# Altium project figo_pcb_v4.PrjPcb
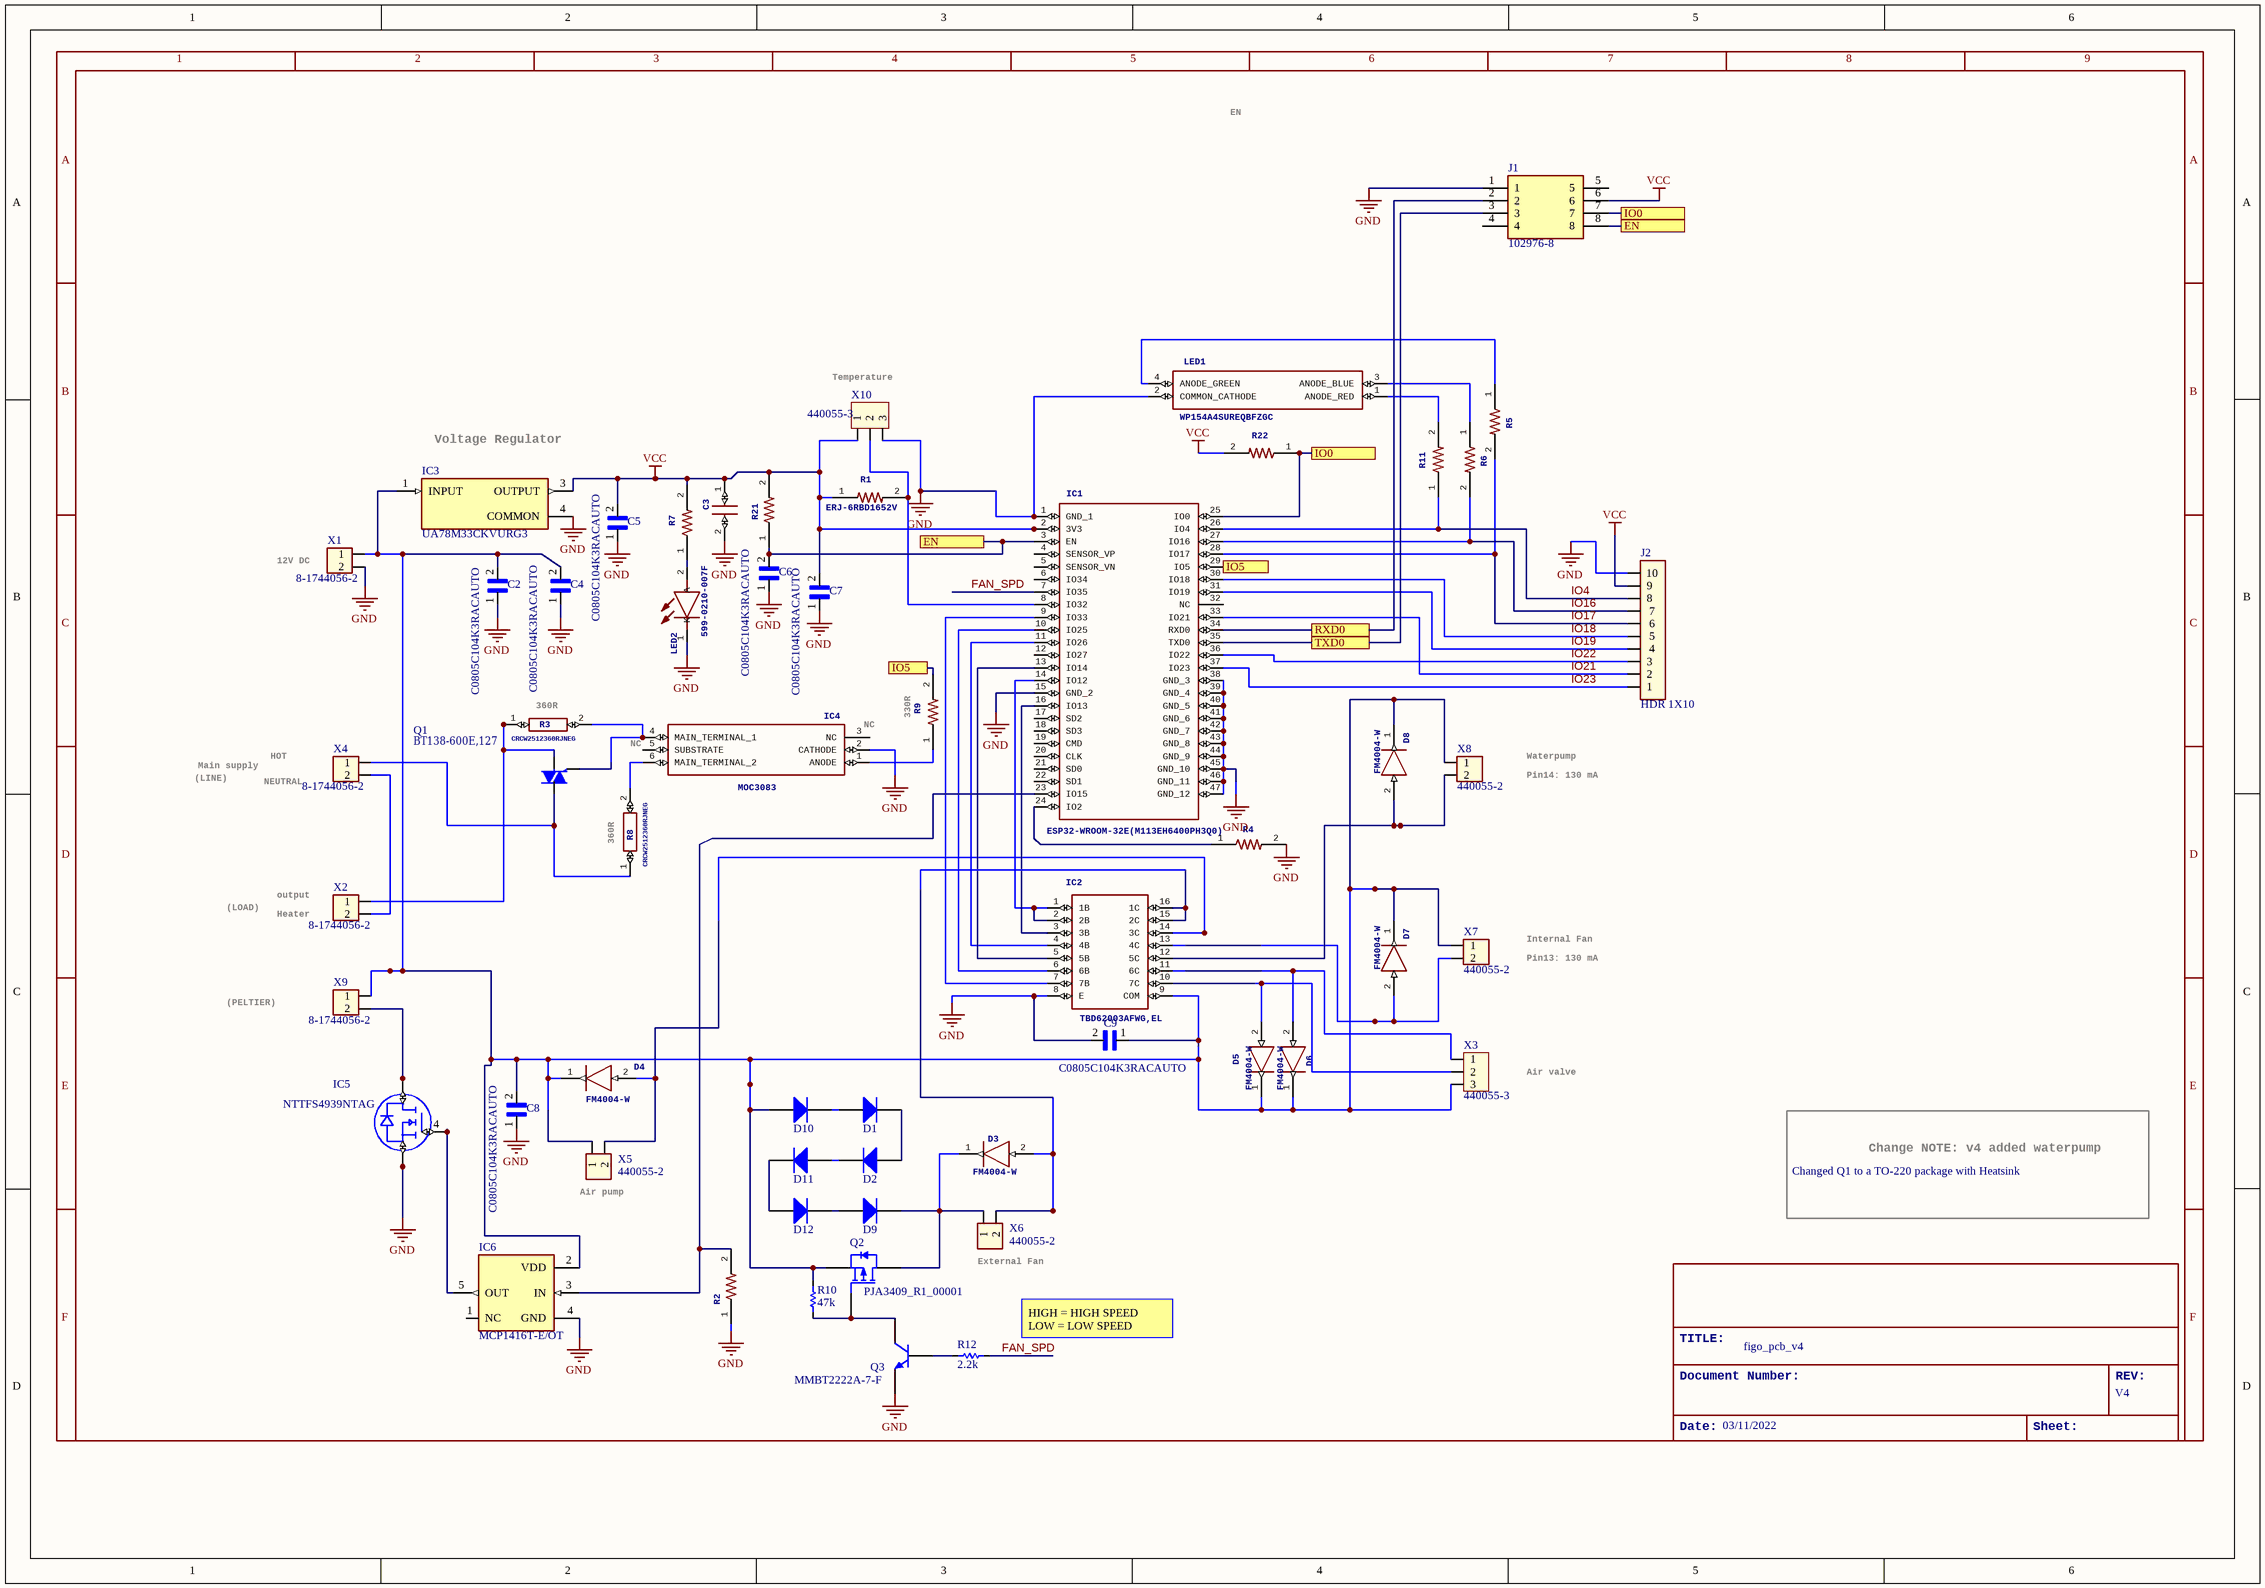
[diagram p0: figo_pcb_v4.SchDoc]
1 sheet, 57 parts. Net scope: flat (ports and power ports of the same name join across sheets).
Board file: figo_pcb_v4.PcbDoc

## Sheet figo_pcb_v4.SchDoc: figo_pcb_v2.1
size 453 x 317 mm; Date: 9/8/2021 10:17:15 AM; SheetNumber: 1; GateName_1: G$1; SymbolName_1: FRAME_B_L; LibraryName: frames; DeviceSetName: FRAME_B_L; GateName_2: G$2; SymbolName_2: DOCFIELD; Sheet: Sheet:; REV: REV:

### Parts
C2  C0805C104K3RACAUTO  [CAPC2012X88N]
C3  GRM21BR60J107ME15L  [CAPC2012X145N]  (value not drawn)
C4  C0805C104K3RACAUTO  [CAPC2012X88N]
C5  C0805C104K3RACAUTO  [CAPC2012X88N]
C6  C0805C104K3RACAUTO  [CAPC2012X88N]
C7  C0805C104K3RACAUTO  [CAPC2012X88N]
C8  C0805C104K3RACAUTO  [CAPC2012X88N]
C9  C0805C104K3RACAUTO  [CAPC2012X88N]
D1  Diode  [SOD-123F]  (value not drawn)
D2  Diode  [SOD-123F]  (value not drawn)
D3  FM4004-W  [DIONM5025X231N]
D4  FM4004-W  [DIONM5025X231N]
D5  FM4004-W  [DIONM5025X231N]
D6  FM4004-W  [DIONM5025X231N]
D7  FM4004-W  [DIONM5025X231N]
D8  FM4004-W  [DIONM5025X231N]
D9  Diode  [SOD-123F]  (value not drawn)
D10  Diode  [SOD-123F]  (value not drawn)
D11  Diode  [SOD-123F]  (value not drawn)
D12  Diode  [SOD-123F]  (value not drawn)
IC1  ESP32-WROOM-32E(M113EH6400PH3Q0)  [ESP32WROOM32D4MB]
IC2  TBD62003AFWG,EL  [SOIC127P600X175-16N]
IC3  UA78M33CKVURG3  [TO229P990X252-3N]
IC4  MOC3083  [DIP762W60P254L750H600Q6N]
IC5  NTTFS4939NTAG  [DFN330X330X75-8N]
IC6  MCP1416T-E/OT  [SOT23-5]
J1  102976-8  [TE_102976-8]
J2  HDR 1X10  [TH,POS-10S, R/A LOCK, 2.54mm]
LED1  WP154A4SUREQBFZGC  [L-154A4SUREQBFZGEC]
LED2  599-0210-007F  [LEDC3216X90N]
Q1  ‎BT138-600E,127‎  [TO254P1040X460X1975-3]
Q2  Manufacturer Part Number: PJA3409_R1_00001  [SOT23]  (hidden comment: MOSFET-P_D)
Q3  Manufacturer Part Number: MMBT2222A-7-F  [SOT23]  (hidden comment: NPN)
R1  ERJ-6RBD1652V  [RESC2012X70]
R2  ERJ-6RBD1652V  [RESC2012X70]  (value not drawn)
R3  CRCW2512360RJNEG  [RESC6332X70N]
R4  ERJ-6RBD1652V  [RESC2012X70]  (value not drawn)
R5  ERJ-6RBD1652V  [RESC2012X70]  (value not drawn)
R6  ERJ-6RBD1652V  [RESC2012X70]  (value not drawn)
R7  ERJ-6RBD1652V  [RESC2012X70]  (value not drawn)
R8  CRCW2512360RJNEG  [RESC6332X70N]
R9  ERJ-6RBD1652V  [RESC2012X70]  (value not drawn)
R10  Val: 47k  [R0805]
R11  ERJ-6RBD1652V  [RESC2012X70]  (value not drawn)
R12  Val: 2.2k  [R0805]
R21  ERJ-6RBD1652V  [RESC2012X70]  (value not drawn)
R22  ERJ-6RBD1652V  [RESC2012X70]  (value not drawn)
X1  8-1744056-2  [TE-ECOPWR-2S R/A, 3.96mm]
X2  8-1744056-2  [TE-ECOPWR-2S R/A, 3.96mm]
X3  440055-3  [TE-HPI-3P TH R/A 2.0mm]
X4  8-1744056-2  [TE-ECOPWR-2S R/A, 3.96mm]
X5  440055-2  [TE-HPI-2P TH R/A 2.0mm]
X6  440055-2  [TE-HPI-2P TH R/A 2.0mm]
X7  440055-2  [TE-HPI-2P TH R/A 2.0mm]
X8  440055-2  [TE-HPI-2P TH R/A 2.0mm]
X9  8-1744056-2  [TE-ECOPWR-2S R/A, 3.96mm]
X10  440055-3  [TE-HPI-3P TH R/A 2.0mm]

### Ports
EN, IO0, IO5, RXD0, TXD0

### Nets
GND: C2.1 C3.2 C4.1 C5.1 C6.1 C7.1 C8.1 C9.2 IC1.1(GND_1) IC1.15(GND_2) IC1.38(GND_3) IC1.39(GND_4) IC1.40(GND_5) IC1.41(GND_6) IC1.42(GND_7) IC1.43(GND_8) IC1.44(GND_9) IC1.45(GND_10) IC1.46(GND_11) IC1.47(GND_12) IC2.8(E) IC3.4(COMMON) IC4.2(CATHODE) IC5.1(S) IC5.2(S) IC5.3(S) IC6.4(GND) J1.1 J2.10 LED1.2(COMMON_CATHODE) LED2.1(K) Q3.2(E) R2.1 R4.2 X1.2 X10.3
VCC: C3.1 C5.2 C7.2 IC1.2(3V3) IC3.3(OUTPUT) J1.6 J2.9 R1.1 R7.2 R21.2 R22.2 X10.1
FAN_SPD: IC1.7(IO35) R12.2
IO4: IC1.26(IO4) J2.8 R11.1
IO16: IC1.27(IO16) J2.7 R6.2
IO17: IC1.28(IO17) J2.6 R5.2
IO18: IC1.30(IO18) J2.5
IO19: IC1.31(IO19) J2.4
IO21: IC1.33(IO21) J2.2
IO22: IC1.36(IO22) J2.3
IO23: IC1.37(IO23) J2.1
NetC2_2: C2.2 C4.2 C8.2 C9.1 D4.1(K) D5.1(K) D6.1(K) D7.1(K) D8.1(K) D10.1(A) IC2.9(COM) IC3.1(INPUT) IC6.2(VDD) Q2.2(S) R10.2 X1.1 X3.3 X5.1 X7.1 X8.1 X9.1
NetC6_2: C6.2 IC1.3(EN) J1.8 R21.1 ; port EN
NetD1_1: D1.1(A) D10.2(K)
NetD1_2: D1.2(K) D2.1(A)
NetD2_2: D2.2(K) D11.1(A)
NetD3_1: D3.1(K) D9.2(K) Q2.3(D) X6.1
NetD3_2: D3.2(A) IC2.15(2C) IC2.16(1C) X6.2
NetD4_2: D4.2(A) IC2.14(3C) X5.2
NetD5_2: D5.2(A) IC2.10(7C) X3.2
NetD6_2: D6.2(A) IC2.11(6C) X3.1
NetD7_2: D7.2(A) IC2.13(4C) X7.2
NetD8_2: D8.2(A) IC2.12(5C) X8.2
NetD9_1: D9.1(A) D12.2(K)
NetD11_2: D11.2(K) D12.1(A)
NetIC1_8: IC1.8(IO32) R1.2 X10.2
NetIC1_9: IC1.9(IO33) IC2.7(7B)
NetIC1_10: IC1.10(IO25) IC2.6(6B)
NetIC1_11: IC1.11(IO26) IC2.4(4B)
NetIC1_13: IC1.13(IO14) IC2.5(5B)
NetIC1_14: IC1.14(IO12) IC2.1(1B) IC2.2(2B)
NetIC1_16: IC1.16(IO13) IC2.3(3B)
NetIC1_23: IC1.23(IO15) IC6.3(IN) R2.2
NetIC1_24: IC1.24(IO2) R4.1
NetIC1_25: IC1.25(IO0) J1.7 R22.1 ; port IO0
NetIC1_29: IC1.29(IO5) R9.2 ; port IO5
NetIC1_34: IC1.34(RXD0) J1.2 ; port RXD0
NetIC1_35: IC1.35(TXD0) J1.3 ; port TXD0
NetIC4_1: IC4.1(ANODE) R9.1
NetIC4_4: IC4.4(MAIN_TERMINAL_1) Q1.3(G) R3.2
NetIC4_6: IC4.6(MAIN_TERMINAL_2) R8.2
NetIC5_4: IC5.4(G) IC6.5(OUT)
NetIC5_5: IC5.5(D) IC5.6(D) IC5.7(D) IC5.8(D) IC5.D IC5.D.(D) X9.2
NetLED1_1: LED1.1(ANODE_RED) R11.2
NetLED1_3: LED1.3(ANODE_BLUE) R6.1
NetLED1_4: LED1.4(ANODE_GREEN) R5.1
NetLED2_2: LED2.2(A) R7.1
NetQ1_1: Q1.1(A1) R3.1 X2.1
NetQ1_2: Q1.2(A2) R8.1 X4.1
NetQ2_1: Q2.1(G) Q3.3(C) R10.1
NetQ3_1: Q3.1(B) R12.1
NetX2_2: X2.2 X4.2

Not connected (* = marked no-connect by the designer): IC1 4(SENSOR_VP) 5(SENSOR_VN) 6(IO34) 12(IO27) 17(SD2) 18(SD3) 19(CMD) 20(CLK) 21(SD0) 22(SD1) 32(NC); IC4 3(NC) 5(SUBSTRATE); IC6 1(NC); J1 4 5

### Notes on the sheet
- EN
- (near X10) Temperature
- (near IC3) Voltage Regulator
- (near X1) 12V DC
- (near R3) 360R
- (near IC4) NC
- (near R9) 330R
- (LINE)
- Main supply
- NEUTRAL
- HOT
- Waterpump
- Pin14: 130 mA
- (near R8) 360R
- (LOAD)
- output
- Heater
- Internal Fan
- Pin13: 130 mA
- (PELTIER)
- Air valve
- Change NOTE: v4 added waterpump
- (near X5) Air pump
- Changed Q1 to a TO-220 package with Heatsink
- (near X6) External Fan
- (near R12) HIGH = HIGH SPEED
  LOW = LOW SPEED
- TITLE:
- figo_pcb_v4
- Document Number:
- V4
- REV:
- Date:
- 03/11/2022
- Sheet:
- 1
- 2
- 3
- 4
- 5
- 6
- 7
- 8
- 9
- A
- B
- C
- D
- E
- F

### Library data of the parts
C2 C4-C9 = C0805C104K3RACAUTO: 0.1ÂµF Â±10% 25V Ceramic Capacitor X7R 0805 (2012 Metric); MF: KEMET; Purchase-URL: https://pricing.snapeda.com/search/part/C0805C104K3RACAUTO/?ref=eda; Value: *; SnapEDA_Link: https://www.snapeda.com/parts/C0805C104K3RACAUTO/KEMET/view-part/1798222/?ref=snap; Package: 0805 KEMET; Check_prices: https://www.snapeda.com/parts/C0805C104K3RACAUTO/KEMET/view-part/1798222/?ref=eda; MP: C0805C104K3RACAUTO; Availability: Good; Price: None
C3 = GRM21BR60J107ME15L: Multilayer Ceramic Capacitors MLCC - SMD/SMT 100UF   6.3V   20%        0805   Source:  Datasheet; MANUFACTURER_NAME: Murata Electronics; GateName_1: G$1; SymbolName_1: GRM21BR60J107ME15L; LibraryName: GRM21BR60J107ME15L; DeviceSetName: GRM21BR60J107ME15L; HEIGHT: 1.45mm; MANUFACTURER_PART_NUMBER: GRM21BR60J107ME15L; MOUSER_PART_NUMBER: 81-GRM21BR60J107ME5L; MOUSER_PRICE-STOCK: https://www.mouser.co.uk/ProductDetail/Murata-Electronics/GRM21BR60J107ME15L?qs=qSv5qXjCIG0V4cgMTBuIkA%3D%3D
D1 D2 D9-D12 = Diode: Manufacturer: Pan Jit; Manufacturer Part Number: GS1001FL_R1_00001; Forward Current: 1A; Max Reverse Current: 1uA; Max Repetitive Reverse Voltage (Vrrm): 100V; Peak Non-Repetitive Surge Current: 16.5A; Supplier 1: Digi-Key; Supplier Part Number 1: 3757-GS1001FL_R1_00001CT-ND; RoHS: Yes; Category: Rectifier Diodes; Stock 1: 10971; Pricing 1: 1=0.24, 10=0.199, 100=0.1057, 500=0.06952, 1000=0.04728 (USD); Mounting Technology: Surface Mount; Min Operating Temperature: -50°C; Max Operating Temperature: 150°C; RoHS Compliant: Yes; ComponentLink1URL: http://www.panjit.com/upload/product/18/GS1000FL_SERIES.pdf?src-supplier=Avnet; ComponentLink1Description: http://www.panjit.com/upload/product/18/GS1000FL_SERIES.pdf?src-supplier=Avnet
D3-D8 = FM4004-W: Rectifiers 1N4004 1A 400V   Source:  Datasheet; MANUFACTURER_NAME: Rectron; GateName_1: G$1; SymbolName_1: FM4004-W; LibraryName: FM4004-W; DeviceSetName: FM4004-W; HEIGHT: 2.31mm; MANUFACTURER_PART_NUMBER: FM4004-W; MOUSER_PART_NUMBER: 583-FM4004; MOUSER_PRICE-STOCK: https://www.mouser.co.uk/ProductDetail/Rectron/FM4004-W?qs=Iw9Ubr57Px3IHNH1bE4l9w%3D%3D
IC1 = ESP32-WROOM-32D__4MB_: WiFi Modules (802.11) SMD Module, ESP32-D0WD, 32Mbits SPI flash, UART mode, PCB antenna   Source:  Datasheet; MANUFACTURER_NAME: Espressif Systems; MANUFACTURER_PART_NUMBER: ESP32-WROOM-32D (4MB); GateName_1: G$1; SymbolName_1: ESP32-WROOM-32D__4MB_; LibraryName: ESP32-WROOM-32D__4MB_; DeviceSetName: ESP32-WROOM-32D__4MB_; HEIGHT: 3.2mm; MOUSER_PART_NUMBER: 356-ESP32WROOM-32D; MOUSER_PRICE-STOCK: https://www.mouser.co.uk/ProductDetail/Espressif-Systems/ESP32-WROOM-32D-4MB?qs=GBLSl2AkirvkALo4fyKM5Q%3D%3D
IC2 = ULN2003ADR: Trans Darlington NPN 50V 0.5A SOIC16 Texas Instruments ULN2003ADR, 7-element NPN Darlington Transistor Array, 0.5 A 50 V, 16-Pin SOIC   Source:  Datasheet; GateName_1: G$1; SymbolName_1: ULN2003ADR; LibraryName: ULN2003ADR; DeviceSetName: ULN2003ADR; HEIGHT: 1.75mm; MANUFACTURER_NAME: Texas Instruments; MANUFACTURER_PART_NUMBER: ULN2003ADR; MOUSER_PART_NUMBER: 595-ULN2003ADR; MOUSER_PRICE-STOCK: https://www.mouser.co.uk/ProductDetail/Texas-Instruments/ULN2003ADR?qs=D5pVkbrsqqI8WxXD0eSvDA%3D%3D
IC4 = MOC3083: Triac & SCR Output Optocouplers 800VDRM IFT=5mA 6 Pin Optocoupler   Source:  Datasheet; MANUFACTURER_NAME: Lite-On; GateName_1: G$1; SymbolName_1: MOC3083; LibraryName: MOC3083; DeviceSetName: MOC3083; HEIGHT: 6mm; MANUFACTURER_PART_NUMBER: MOC3083; MOUSER_PART_NUMBER: 859-MOC3083; MOUSER_PRICE-STOCK: https://www.mouser.co.uk/ProductDetail/Lite-On/MOC3083?qs=2BArZ0I3Qlm%252BsCXQP3OOeA%3D%3D
IC5 = NTTFS4939NTAG: Power MOSFET 30V 56A 5.5 mOhm Single N-Channel u8FL; Package: None; Price: None; Value: *; MP: NTTFS4939NTAG; Availability: Unavailable
IC6 = MCP1416T-E/OT: 1.5A, High Speed Power MOSFET Driver Non Inverting; Manufacturer: Microchip; Package Body Material: Plastic; High Side Driver: No; Interface IC Type: BUFFER OR INVERTER BASED MOSFET DRIVER; Number of Functions: 1; Package Equivalence Code: TSOP5/6,.11,37; Power Supplies: 4.5/18V; Time @ Peak Reflow Temperature-Max (s): 40s; Turn-Off Delay Time: 0.06us; Turn-On Delay Time: 0.055us; Qualification Status: Not Qualified; Supplier 1: Digi-Key; RoHS: Yes; Category: Gate Drivers; Pricing 1: 1=0.80000, 25=0.69000 (USD); Package Code: LSSOP; Number of Pins: 5; Package Shape: Rectangular; Terminal Finish: Tin; Min Operating Temperature: -40°C; Max Operating Temperature: 125°C; JESD-609 Code: e3; JESD-30 Code: R-PDSO-G5; Moisture Sensitivity Level: 1; Output Peak Current Limit-Nom: 1.5A; Package Style: SMALL OUTLINEMeter; Peak Reflow Temperature (Cel): 260°C; Surface Mount: Yes; Technology: CMOS; Terminal Form: Gull Wing; Terminal Position: DUAL; Length: 2.9mm; Width: 1.55mm; Height - Seated (Max): 1.45mm; Terminal Pitch: 0.95mm; Temperature Grade: AUTOMOTIVE; REACH SVHC: Yes; RoHS Compliant: Yes; ComponentLink1URL: https://datasheet.ciiva.com:443/pdfs/VipMasterIC/IC/MCHP/MCHPS05696/MCHPS05696-1.pdf?src-supplier=IHS+Markit; ComponentLink1Description: https://datasheet.ciiva.com:443/pdfs/VipMasterIC/IC/MCHP/MCHPS05696/MCHPS05696-1.pdf?src-supplier=IHS+Markit; ComponentLink2URL: https://datasheet.ciiva.com/3228/22092d-mcp1415-3228496.pdf?src-supplier=Avnet; ComponentLink2Description: https://datasheet.ciiva.com/3228/22092d-mcp1415-3228496.pdf?src-supplier=Avnet; ComponentLink3URL: https://datasheet.ciiva.com/23952/1669445-23952041.pdf?src-supplier=Newark; ComponentLink3Description: https://datasheet.ciiva.com/23952/1669445-23952041.pdf?src-supplier=Newark; ComponentLink4URL: https://datasheet.ciiva.com/1500/1669445-1500307.pdf?src-supplier=Element14; ComponentLink4Description: https://datasheet.ciiva.com/1500/1669445-1500307.pdf?src-supplier=Element14; ComponentLink5URL: https://datasheet.ciiva.com/22694/1669445-22694330.pdf?src-supplier=Element14; ComponentLink5Description: https://datasheet.ciiva.com/22694/1669445-22694330.pdf?src-supplier=Element14; ComponentLink6URL: https://datasheet.ciiva.com/3226/22092d-mcp1415-3226504.pdf?src-supplier=Avnet; ComponentLink6Description: https://datasheet.ciiva.com/3226/22092d-mcp1415-3226504.pdf?src-supplier=Avnet; ComponentLink7URL: https://datasheet.ciiva.com/1954/22092e-1954917.pdf?src-supplier=Digi-Key; ComponentLink7Description: https://datasheet.ciiva.com/1954/22092e-1954917.pdf?src-supplier=Digi-Key; ComponentLink8URL: https://datasheet.ciiva.com/1954/22092e-1954918.pdf?src-supplier=Digi-Key; ComponentLink8Description: https://datasheet.ciiva.com/1954/22092e-1954918.pdf?src-supplier=Digi-Key; ComponentLink9URL: https://datasheet.ciiva.com/1954/22092e-1954916.pdf?src-supplier=Digi-Key; ComponentLink9Description: https://datasheet.ciiva.com/1954/22092e-1954916.pdf?src-supplier=Digi-Key; ComponentLink10URL: https://datasheet.ciiva.com/29305/651398-da-01-en-ic-mosfet-drv-mcp1416t-e-ot-sot-23-5-mcp-29305420.pdf?src-supplier=Conrad; ComponentLink10Description: https://datasheet.ciiva.com/29305/651398-da-01-en-ic-mosfet-drv-mcp1416t-e-ot-sot-23-5-mcp-29305420.pdf?src-supplier=Conrad; Supplier Part Number 1: MCP1416T-E/OTCT-ND; Manufacturer Part Number: MCP1416T-E/OT
J1 = 102976-8: Conn Unshrouded Header HDR 8 POS 2.54mm Solder ST Thru-Hole Carton; Number_of_Positions: 8; Product_Type: Connector; MF: TE Connectivity; Centerline_Pitch: 2.54 mm[.1 in]; Value: *; Price: None; Package: None; SnapEDA_Link: https://www.snapeda.com/parts/102976-8/TE%20Connectivity%20AMP%20Connectors/view-part/1332152/?ref=snap; Availability: Warning; EU_RoHS_Compliance: Not Compliant; MP: 102976-8; Check_prices: https://www.snapeda.com/parts/102976-8/TE%20Connectivity%20AMP%20Connectors/view-part/1332152/?ref=eda
J2 = HDR 1X10: HEADER 1X10
LED1 = WP154A4SUREQBFZGC: Standard LEDs - Through Hole RGB 630/525/465nm 750/420/750mcd 60Deg   Source:  Datasheet; MANUFACTURER_NAME: Kingbright; GateName_1: G$1; SymbolName_1: WP154A4SUREQBFZGC; LibraryName: WP154A4SUREQBFZGC; DeviceSetName: WP154A4SUREQBFZGC; HEIGHT: mm; MANUFACTURER_PART_NUMBER: WP154A4SUREQBFZGC; MOUSER_PART_NUMBER: 604-WP154A4SUREQBFZG; MOUSER_PRICE-STOCK: https://www.mouser.co.uk/ProductDetail/Kingbright/WP154A4SUREQBFZGC?qs=vEWui5pQpauEeiZ%252Btq6oqQ%3D%3D
LED2 = 599-0210-007F: Standard LEDs - SMD SMD 1206 RED   Source:  Datasheet; MANUFACTURER_NAME: Dialight; GateName_1: G$1; SymbolName_1: 599-0210-007F; LibraryName: 599-0210-007F; DeviceSetName: 599-0210-007F; HEIGHT: 0.9mm; MANUFACTURER_PART_NUMBER: 599-0210-007F; MOUSER_PART_NUMBER: 645-599-0210-007F; MOUSER_PRICE-STOCK: https://www.mouser.co.uk/ProductDetail/Dialight/599-0210-007F?qs=gTYE2QTfZfRnv7f5dCtvhw%3D%3D
Q1 = BTA06-600BRG: TRIAC Standard 600V 6A Through Hole TO-220AB; MF: STMicroelectronics; MP: BTA06-600BRG; SnapEDA_Link: https://www.snapeda.com/parts/BTA06-600BRG/STMicroelectronics/view-part/107180/?ref=snap; Availability: Unavailable; Package: TO-220 STMicroelectronics; Value: *; Price: None
Q2 = MOSFET-P_D: 30V P-channel Enhancement Mode Mosfet; Manufacturer: Pan Jit; Note: Pin 4 not drawn and electrically connected to Pin 2.; Published: 8-Jun-2000; LatestRevisionDate: 17-Jul-2002; LatestRevisionNote: Re-released for DXP Platform.; DatasheetVersion: PD-9.390D; PackageVersion: Feb-1997; PackageReference: TO-220AB; Publisher: Altium Limited; PackageDescription: TO, Thru-Hole, Vertical, Heatsink Mounted; 3 In-Line Leads; Pitch 2.54 mm; ComponentLink1Description: Manufacturer Link; ComponentLink1URL: http://www.irf.com/; Supplier 1: Digi-Key; Supplier Part Number 1: 3757-PJA3409_R1_00001CT-ND; RoHS: No; Category: Uncategorized; Stock 1: 107416; Pricing 1: 1=0.49000, 10=0.36300, 100=0.20550, 500=0.13608, 1000=0.10433 (USD)
Q3 = NPN: NPN Ic=600mA Vceo=40V hfe=100~300 fT=300MHz P=310mW SOT-23; Manufacturer: Diodes; Designer: Roomi; Designer Email: roomi.freel@gmail.com; hFE Min: 100; Frequency: 300MHz; Max Power Dissipation: 300mW; Number of Elements: 1; Collector Emitter Voltage (VCEO): 40V; Collector Base Voltage (VCBO): 75V; Emitter Base Voltage (VEBO): 6V; Collector Emitter Saturation Voltage: 1V; Max Collector Current: 600mA; Power Dissipation: 350mW; Element Configuration: Single; Current: 1A; Val: NPN; Supplier 1: Digi-Key; Supplier Part Number 1: MMBT2222A-FDICT-ND; RoHS: Yes; Category: BJTs; Stock 1: 2753666; Pricing 1: 1=0.14000, 10=0.13200, 100=0.07200, 500=0.04430, 1000=0.03021 (USD); Mounting Technology: Surface Mount; Case/Package: SOT-23; Pins: 3; Weight: 0.000282oz; Contact Plating: Tin,Matte; Min Operating Temperature: -55°C; Max Operating Temperature: 150°C; Packaging: Tape and Reel; Package Quantity: 3000; Polarity: NPN; Continuous Collector Current: 600mA; Collector Emitter Breakdown Voltage: 40V; Transition Frequency: 300MHz; Max Breakdown Voltage: 40V; Clock Frequency: 300MHz; Termination: SMD/SMT; Gain Bandwidth Product: 300MHz; Voltage Rating (DC): 40V; Current Rating: 600mA; Voltage: 40V; Collector-emitter Voltage-Max: 1V; Series: Automotive, AEC-Q101; Length: 3.05mm; Width: 1.4mm; Height: 1mm; Radiation Hardening: No; Reach SVHC Compliant: Yes; Lead Free: Lead Free; RoHS Compliant: Yes; ComponentLink1URL: https://datasheet.ciiva.com/8029/ds30041-8029709.pdf?src-supplier=Element14; ComponentLink1Description: https://datasheet.ciiva.com/8029/ds30041-8029709.pdf?src-supplier=Element14; ComponentLink2URL: https://datasheet.ciiva.com/11201/ds30041-11201864.pdf?src-supplier=Avnet; ComponentLink2Description: https://datasheet.ciiva.com/11201/ds30041-11201864.pdf?src-supplier=Avnet; ComponentLink3URL: https://datasheet.ciiva.com/16199/ds30041-16199045.pdf?src-supplier=Future+Electronics; ComponentLink3Description: https://datasheet.ciiva.com/16199/ds30041-16199045.pdf?src-supplier=Future+Electronics; Supplier 2: Mouser; Supplier Part Number 2: 621-MMBT2222A-F
R1 R2 R4-R7 R9 R11 R21 R22 = ERJ-6RBD1652V: GateName_1: G$1; MF: Panasonic; SymbolName_1: ERJ-6RBD1652V; LibraryName: ERJ-6RBD1652V; DeviceSetName: ERJ-6RBD1652V; AVAILABILITY: Unavailable; MP: ERJ-6RBD1652V; PACKAGE: 0805 Panasonic; PRICE: None
R3 R8 = CRCW2512360RJNEG: VISHAY - CRCW2512360RJNEG - RES, THICK FILM, 360R, 5%, 0.5W, 2512   Source:  Datasheet; GateName_1: G$1; SymbolName_1: CRCW2512360RJNEG; LibraryName: CRCW2512360RJNEG; DeviceSetName: CRCW2512360RJNEG; HEIGHT: 0.7mm; MANUFACTURER_NAME: Vishay; MANUFACTURER_PART_NUMBER: CRCW2512360RJNEG; MOUSER_PART_NUMBER: 71-CRCW2512J-360-E3; MOUSER_PRICE-STOCK: https://www.mouser.com/Search/Refine.aspx?Keyword=71-CRCW2512J-360-E3
R10 R12 = Resistor: General Purpose Chip Resistor; Designer: Roomi; Designer Email: roomi.freel@gmail.com
X1 X2 X4-X9 = HDR 1X2: HEADER 1X2
X3 X10 = HDR 1X3: HEADER 1X3
IC3 = UA78M33CKVURG3: Package: None; Availability: Unavailable; Price: None; Value: *; MP: UA78M33CKVURG3